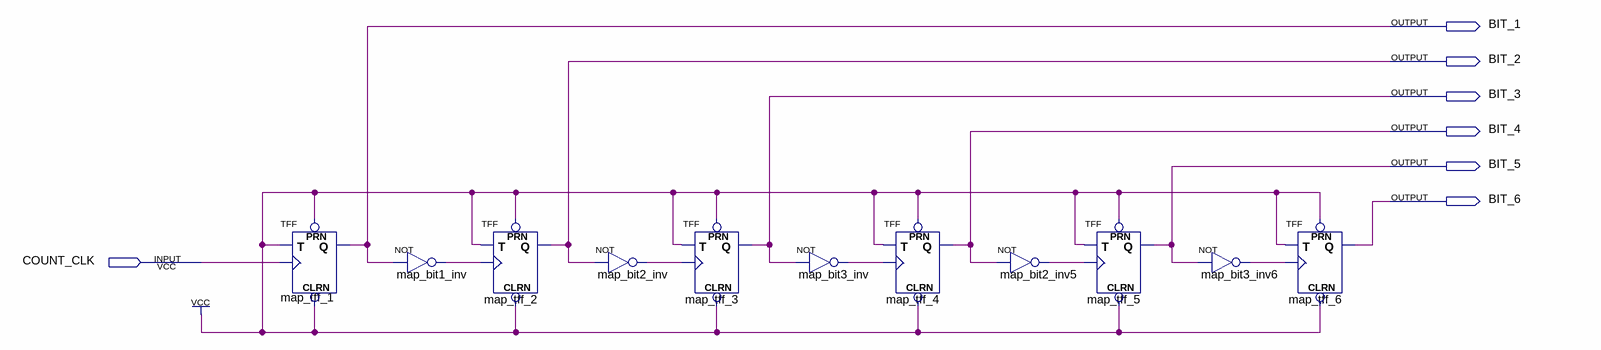
[diagram p0: schematic sheet]
// Quartus schematic counter.bdf as structural Verilog: 11 symbols, 7 pins
module counter (
  input  COUNT_CLK,
  output BIT_1,
  output BIT_2,
  output BIT_3,
  output BIT_4,
  output BIT_5,
  output BIT_6
);

  wire map_bit1_inv_out, map_bit2_inv5_out, map_bit2_inv_out, map_bit3_inv6_out, map_bit3_inv_out;

  TFF map_tff_1 (.PRN(1'b1), .CLRN(1'b1), .T(1'b1), .CLK(COUNT_CLK), .Q(BIT_1));
  not map_bit1_inv (map_bit1_inv_out, BIT_1);
  TFF map_tff_2 (.PRN(1'b1), .CLRN(1'b1), .T(1'b1), .CLK(map_bit1_inv_out), .Q(BIT_2));
  not map_bit2_inv (map_bit2_inv_out, BIT_2);
  TFF map_tff_3 (.PRN(1'b1), .CLRN(1'b1), .T(1'b1), .CLK(map_bit2_inv_out), .Q(BIT_3));
  not map_bit3_inv (map_bit3_inv_out, BIT_3);
  TFF map_tff_4 (.PRN(1'b1), .CLRN(1'b1), .T(1'b1), .CLK(map_bit3_inv_out), .Q(BIT_4));
  not map_bit2_inv5 (map_bit2_inv5_out, BIT_4);
  TFF map_tff_5 (.PRN(1'b1), .CLRN(1'b1), .T(1'b1), .CLK(map_bit2_inv5_out), .Q(BIT_5));
  not map_bit3_inv6 (map_bit3_inv6_out, BIT_5);
  TFF map_tff_6 (.PRN(1'b1), .CLRN(1'b1), .T(1'b1), .CLK(map_bit3_inv6_out), .Q(BIT_6));
endmodule
